# Altium schematic sheet Block-Diagram.SchDoc: Block Diagram
size 420 x 297 mm; ENG_APP_DATE: --/--/--; DSN_APP_DATE: --/--/--; CHK_APP_DATE: --/--/--; SheetNumber: 2; SheetTotal: 5
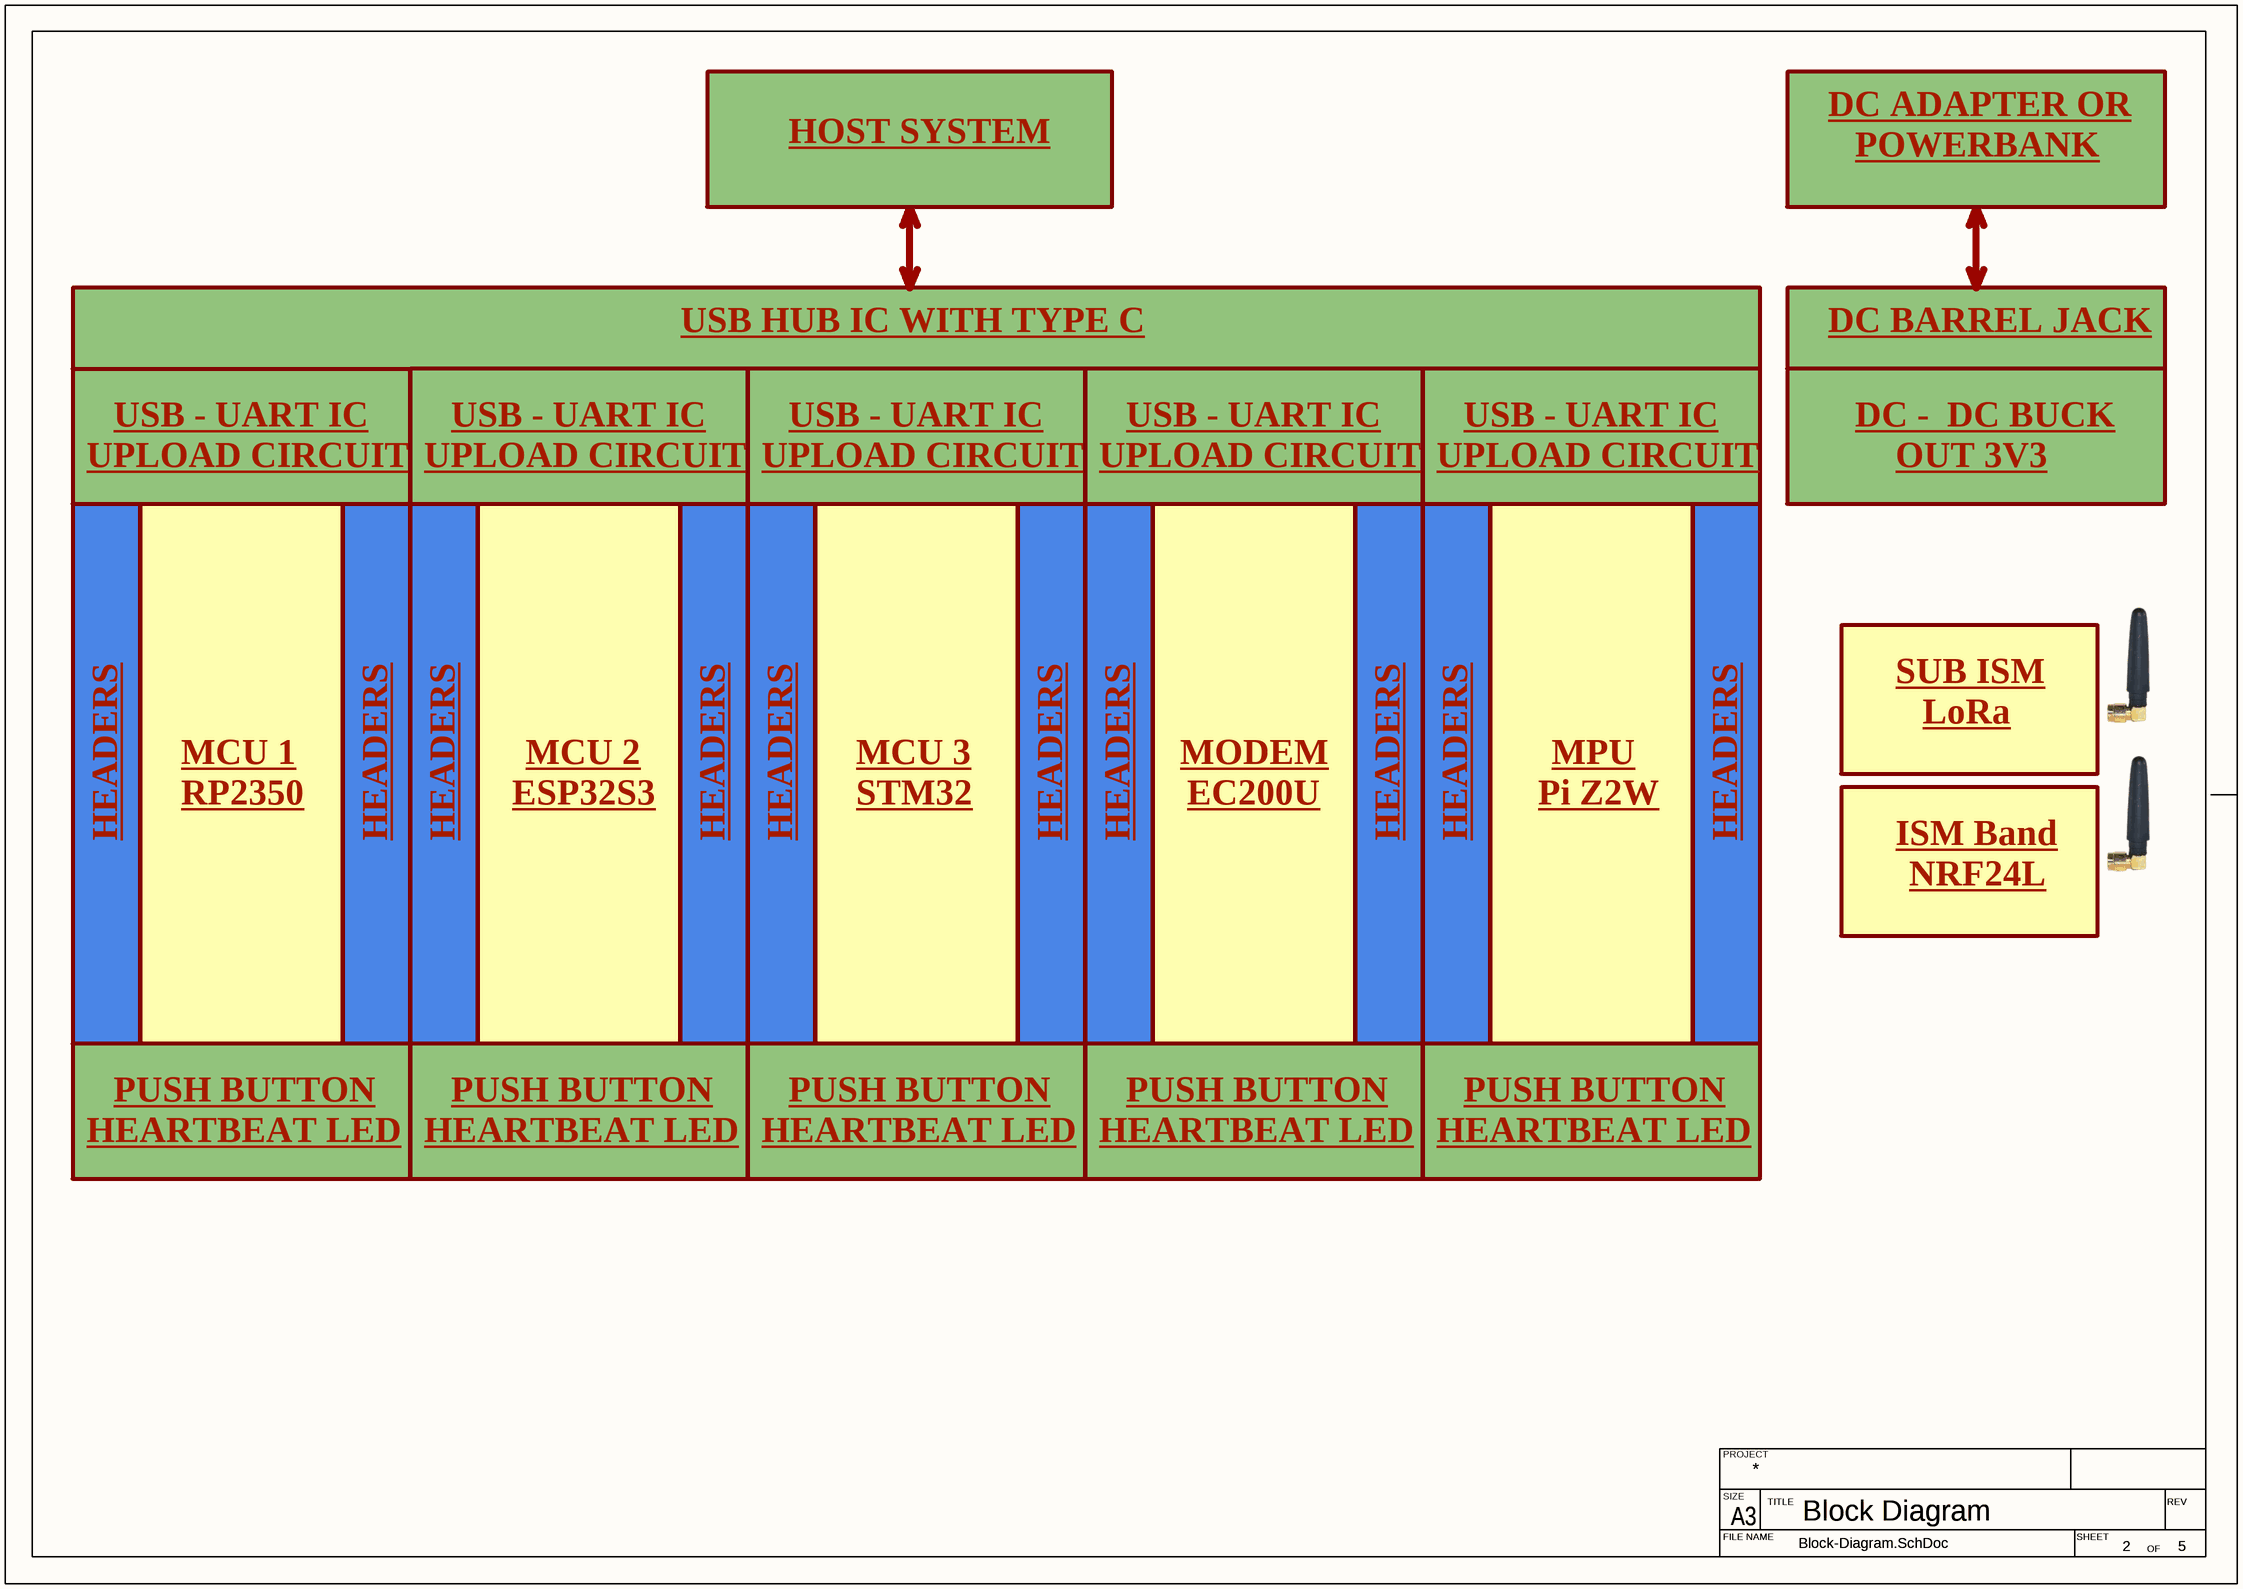
[diagram p0: Block-Diagram.SchDoc]

## Notes on the sheet
- DC ADAPTER OR
- HOST SYSTEM
- POWERBANK
- USB HUB IC WITH TYPE C
- DC BARREL JACK
- USB - UART IC
- DC -  DC BUCK
- UPLOAD CIRCUIT
- OUT 3V3
- SUB ISM
- LoRa
- MCU 1
- MCU 2
- MCU 3
- MODEM
- MPU
- HEADERS
- RP2350
- ESP32S3
- STM32
- EC200U
- Pi Z2W
- ISM Band
- NRF24L
- PUSH BUTTON
- HEARTBEAT LED
- PROJECT
- SIZE
- FILE NAME
- A3
- TITLE
- SHEET
- OF
- REV